# EAGLE schematic v6566_v1 (EAGLE 7.7.0)
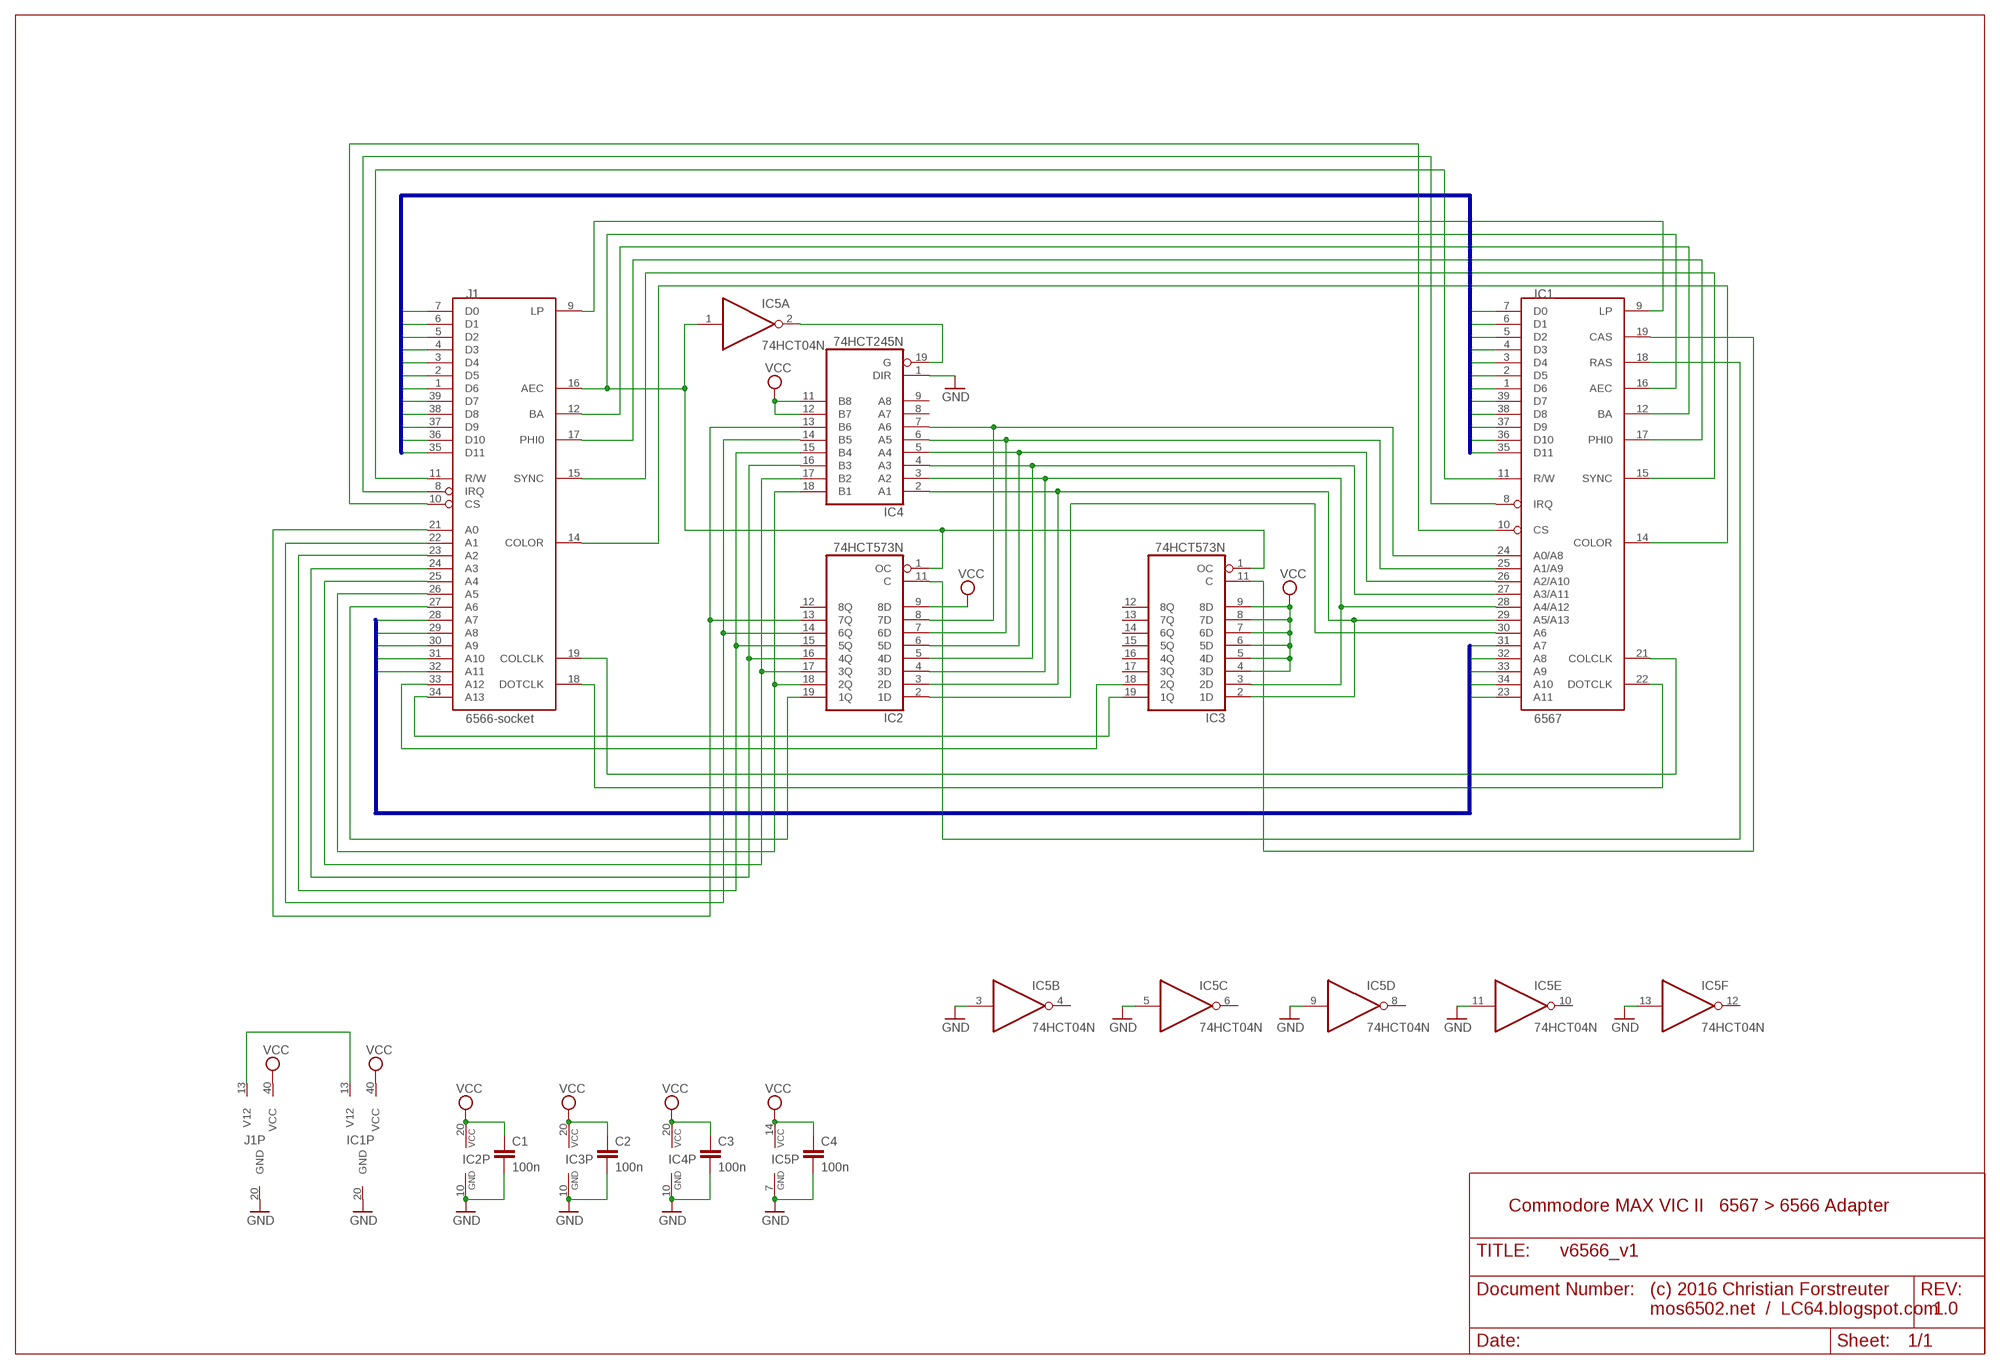
[diagram p0: schematic, sheet 1]

## Parts
C1  100n  C_CERAMIC_5MM  [_C5MM]
C2  100n  C_CERAMIC_5MM  [_C5MM]
C3  100n  C_CERAMIC_5MM  [_C5MM]
C4  100n  C_CERAMIC_5MM  [_C5MM]
IC1  6567  6569  [DIP40]
IC2  74HCT573N  [DIL20]
IC3  74HCT573N  [DIL20]
IC4  74HCT245N  [DIL20]
IC5  74HCT04N  [DIL14]
J1  6566-socket  6566  [DIP40]

## Nets
A7: IC1.31(A7) J1.28(A7)
A8: IC1.32(A8) J1.29(A8)
A9: IC1.33(A9) J1.30(A9)
A10: IC1.34(A10) J1.31(A10)
A11: IC1.23(A11) J1.32(A11)
D0: IC1.7(D0) J1.7(D0)
D1: IC1.6(D1) J1.6(D1)
D2: IC1.5(D2) J1.5(D2)
D3: IC1.4(D3) J1.4(D3)
D4: IC1.3(D4) J1.3(D4)
D5: IC1.2(D5) J1.2(D5)
D6: IC1.1(D6) J1.1(D6)
D7: IC1.39(D7) J1.39(D7)
D8: IC1.38(D8) J1.38(D8)
D9: IC1.37(D9) J1.37(D9)
D10: IC1.36(D10) J1.36(D10)
D11: IC1.35(D11) J1.35(D11)
GND: C1.2 C2.2 C3.2 C4.2 IC1.20(GND) IC2.10(GND) IC3.10(GND) IC4.1(DIR) IC4.10(GND) IC5.3(B:I) IC5.5(C:I) IC5.7(P:GND) IC5.9(D:I) IC5.11(E:I) IC5.13(F:I) J1.20(GND)
N$1: IC1.9(LP) J1.9(LP)
N$2: IC1.16(AEC) IC2.1(OC) IC3.1(OC) IC5.1(A:I) J1.16(AEC)
N$3: IC1.12(BA) J1.12(BA)
N$4: IC1.17(PHI0) J1.17(PHI0)
N$5: IC1.15(SYNC) J1.15(SYNC)
N$6: IC1.14(COLOR) J1.14(COLOR)
N$7: IC1.22(DOTCLK) J1.18(DOTCLK)
N$8: IC1.21(COLCLK) J1.19(COLCLK)
N$9: IC1.11(R/W) J1.11(R/W)
N$10: IC1.8(IRQ) J1.8(IRQ)
N$11: IC1.10(CS) J1.10(CS)
N$12: IC3.19(1Q) J1.34(A13)
N$13: IC3.18(2Q) J1.33(A12)
N$14: IC2.19(1Q) J1.27(A6)
N$15: IC2.18(2Q) IC4.18(B1) J1.26(A5)
N$16: IC2.17(3Q) IC4.17(B2) J1.25(A4)
N$17: IC2.16(4Q) IC4.16(B3) J1.24(A3)
N$18: IC2.15(5Q) IC4.15(B4) J1.23(A2)
N$19: IC2.14(6Q) IC4.14(B5) J1.22(A1)
N$20: IC2.13(7Q) IC4.13(B6) J1.21(A0)
N$21: IC4.19(G) IC5.2(A:O)
N$22: IC1.24(A0/A8) IC2.8(7D) IC4.7(A6)
N$23: IC1.18(RAS) IC2.11(C)
N$24: IC1.19(CAS) IC3.11(C)
N$25: IC1.13(V12) J1.13(V12)
N$26: IC1.26(A2/A10) IC2.6(5D) IC4.5(A4)
N$27: IC1.27(A3/A11) IC2.5(4D) IC4.4(A3)
N$28: IC1.28(A4/A12) IC2.4(3D) IC3.3(2D) IC4.3(A2)
N$29: IC1.29(A5/A13) IC2.3(2D) IC3.2(1D) IC4.2(A1)
N$30: IC1.30(A6) IC2.2(1D)
N$35: IC1.25(A1/A9) IC2.7(6D) IC4.6(A5)
VCC: C1.1 C2.1 C3.1 C4.1 IC1.40(VCC) IC2.9(8D) IC2.20(VCC) IC3.4(3D) IC3.5(4D) IC3.6(5D) IC3.7(6D) IC3.8(7D) IC3.9(8D) IC3.20(VCC) IC4.11(B8) IC4.12(B7) IC4.20(VCC) IC5.14(P:VCC) J1.40(VCC)
Unconnected: IC2.12(8Q) IC3.12(8Q) IC3.13(7Q) IC3.14(6Q) IC3.15(5Q) IC3.16(4Q) IC3.17(3Q) IC4.8(A7) IC4.9(A8) IC5.4(B:O) IC5.6(C:O) IC5.8(D:O) IC5.10(E:O) IC5.12(F:O)

## Buses
D[0..11]
A[7..11]

## Notes on the sheet
- Commodore MAX VIC II   6567 > 6566 Adapter
- (c) 2016 Christian Forstreuter
  mos6502.net  /  LC64.blogspot.com
- 1.0

## Library data of the parts
C1-C4 = _smd:C_CERAMIC: Keramik-Vielschicht-Kondensator
IC1 = 0RB_65xx:6569
IC2 IC3 = 74xx-eu:74*573: 8-bit D latch BUS DRIVER
IC4 = 74xx-eu:74*245: Octal BUS TRANSCEIVER, 3-state
IC5 = 74xx-eu:74*04: Hex INVERTER
J1 = 0RB_65xx:6566: mos 6566 MAX VICII SRAM